# Altium schematic sheet Bottom_Layer.SchDoc
size A4; SheetNumber: 1; SheetTotal: 1
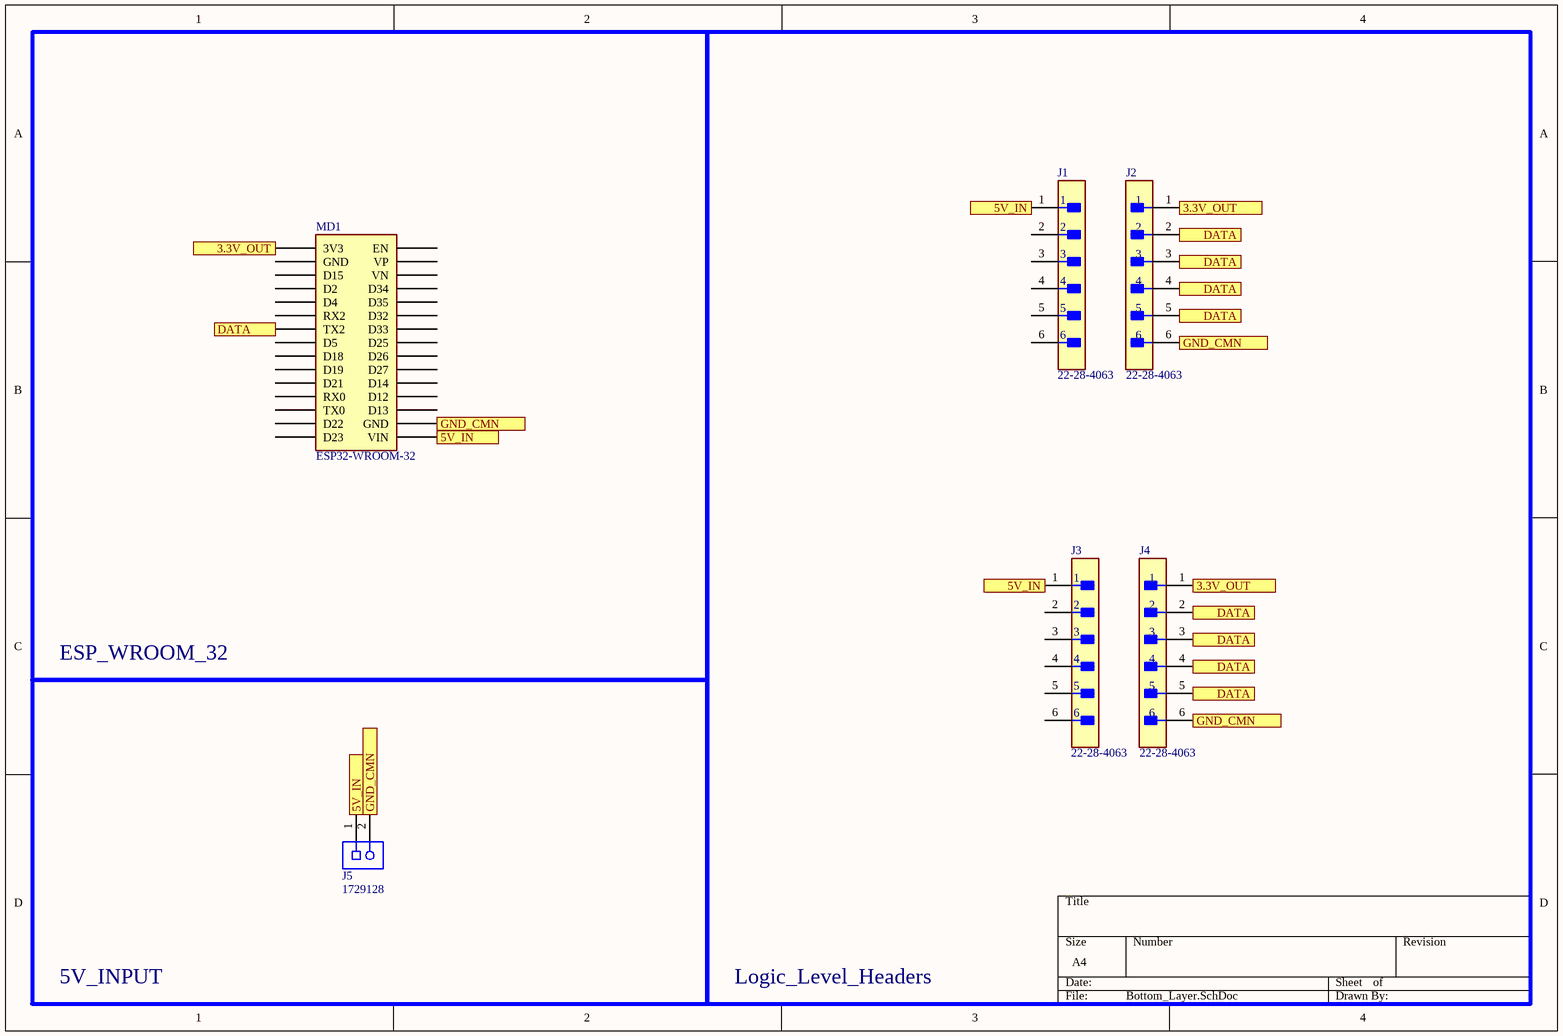
[diagram p0: Bottom_Layer.SchDoc]

## Parts
J1  22-28-4063  [FP-22-28-4063-MFG]
J2  22-28-4063  [FP-22-28-4063-MFG]
J3  22-28-4063  [FP-22-28-4063-MFG]
J4  22-28-4063  [FP-22-28-4063-MFG]
J5  1729128  [PHOE-1729128-2_V]
MD1  ESP32-WROOM-32  [FP-ESP32-WROOM-32-MFG]

## Blocks framed on the sheet
ESP_WROOM_32: MD1
Logic_Level_Headers: J1-J4

## Ports
3.3V_OUT (see TopLayer[1A], TopLayer[4A]), 3.3V_OUT (see TopLayer[1A], TopLayer[4C]), 3.3V_OUT (see TopLayer[4A], TopLayer[4C]), 5V_IN (see TopLayer[1D], TopLayer[2B], TopLayer[3A]), 5V_IN (see TopLayer[1D], TopLayer[2B], TopLayer[3C]), 5V_IN (see TopLayer[1D], TopLayer[3A], TopLayer[3C]), 5V_IN (see TopLayer[2B], TopLayer[3A], TopLayer[3C]), DATA (see TopLayer[1B], TopLayer[4A], TopLayer[4B], TopLayer[4C]), DATA (see TopLayer[1B], TopLayer[4B], TopLayer[4C]), DATA (see TopLayer[4A], TopLayer[4B], TopLayer[4C]), GND_CMN (see TopLayer[1D], TopLayer[2B], TopLayer[4B]), GND_CMN (see TopLayer[1D], TopLayer[2B], TopLayer[4C]), GND_CMN (see TopLayer[1D], TopLayer[4B], TopLayer[4C]), GND_CMN (see TopLayer[2B], TopLayer[4B], TopLayer[4C])

## Nets
3.3V_OUT: J2.1 J4.1 MD1.2(3V3) ; port 3.3V_OUT
5V_IN: J1.1 J3.1 J5.1 MD1.15(VIN) ; port 5V_IN
DATA: J2.2 J2.3 J2.4 J2.5 J4.2 J4.3 J4.4 J4.5 MD1.21(TX2) ; port DATA
GND_CMN: J2.6 J4.6 J5.2 MD1.1(GND) ; port GND_CMN

Not connected (* = marked no-connect by the designer): J1 2 3 4 5 6; J3 2 3 4 5 6; MD1 3(D2) 4(RX0) 5(D21) 6(D12) 7(D13) 8(D27) 9(D14) 10(D33) 11(D25) 12(D26) 17(D18) 18(D19) 19(D15) 20(GND) 22(D5) 28(EN) 30(VP) 31(VN) 32(TX0) 33(D34) 34(D4) 35(RX2) 36(D35) 37(D32) 38(D23) 39(D22)

## Notes on the sheet
- 5V_INPUT

## Library data of the parts
J1-J4 = CMP-04776-000885-1: CONN HEADER VERT 6POS 2.54MM; Number of Circuits: 6; Voltage Rating (DC): 250V; Connector Type: Male Pin; Contact Resistance: 20mR; Glow Wire Compliant: Non-compliant; Gender: Male; Current Rating: 4A; Max Voltage Rating (DC): 250.25kV; Series: KK® 42375; Termination: Solder; Orientation: Straight; Max Operating Temperature: 75°C; Min Operating Temperature: 0°C; Mount: Through Hole; Depth: 2.49mm; Contact Material: Brass; Number of Positions: 6; Contact Mating Length: 0.24inch; Number of Rows: 1; Housing Color: Black; Max Voltage Rating (AC): 250V; Housing Material: Thermoplastic; Packaging: Bulk; Contact Plating: Gold; Contact Type: Male Pin; Package Quantity: 1; Number of Contacts: 6; Voltage Rating: 250V; Lead Free: Lead Free; RoHS Compliant: Yes; Pitch: 2.54mm; Color: Black; Flammability Rating: UL94 V-0; Radiation Hardening: No
J5 = CMP-2000-05815-1: PCB Terminal Block, 13.5 A, 400 V, 2-Pin THD, RoHS, Bulk; Manufacturer: Phoenix Contact; Package Version: 03/2015; No. of Rows: 1; Pitch: 5.08mm; No. of Positions: 2; Voltage Rating: 400V; Current Rating: 13500mA; Manufacturer URL: http://www.phoenixcontact.com/; Datasheet URL: https://datasheet.ciiva.com/16046/1729128-16046181.pdf; RoHS: TRUE; Package URL: https://www.phoenixcontact.com/online/portal/pi/pxc/product_detail_page/!ut/p/b1/3VdJjqNKFDxLH8AFycySyWY2ozFsEPOMMQaDOX1XedGL_1Vdm5YXJleknhSKeBkvI6EA8ncAo3AYoDhBQGco6KN7VURTdemj9us_IEKEZo_YHiPAEWEFmDGOHMORkqKYCORBZxgL7ZoaZYcbFFUZ3fqxSY6GOuxydWUuHqz1ynmMFygu583Bob0Ewr6Sd_l-5m-kAueHiB0jpRwZwe58wwtkpxtMYd_LmGcDRU02dRNEyWt6Y2ti5pSyJ_reIkzIulrqApdnbT11V5jnCKbYNCvhEM1MCpPByat_X379-iThf08CI5GfOPqfBeS3BRoBOdD55AKVv0iLwCMq-2BrzXWSGRH7pUGD9uwXQjiph3xL0DKQwdGa0JImiIOmBNOestqgwTHSSs2oOep-78apyXQBvNi8ZLaFjvjWvcaUEBu0MC6Wbe-d6mB0FAebo2lUWinqYaZs5DAYzV0RP9yitUjnGJ0iI9xhZkT42OCQNUJJhkgWINNQLP2JFP6OpMg3JCVg70jqHT0lvKOnhHf0lPuOnnLf0VPuWx6_dxwUIvwk5WMkT0kLL1mh61l2yZVSzG3pYV_bqo-mj6uMKwKwdnnW8Jh5RTOJzMOA5c-eJDaZQw4mTMPH02PvS_ZAqNVjVTo2WyYLkwH_KU1mmmG5kjRhDqPXLwwVHvVOjCM60-fpXvTDfMGW1PVFVS1r4e4yVDk4ZdNbkUHvqPqQSeian4UD39fNKmachqdJ1NJbyk8rXT9mXTvPk3oE5meulKGgiruPJek-4I9hTT6G8ZLOyRSm2RRVbThERQad5OS28hdt4YW4vG0stgYYzsWsK4_7y6DZMjJSCqri1kyiZR5vD7pwIrNR7QwPHTcLTI5qT7eRlpHrdGiupYlqQDJ7zy_CND8fWWBoLRXxk1RVcXiBQwbTD4Xi7KL-FuO94t9xaqweXzH; PartNumber: 1729128; Package Description: 2-Pin Through Hole Device, Body 8.1 x 10.16 mm, Pitch 5.08 mm; Datasheet Version: 12/2013; Mounting Technology: ThroughHole; Orientation: Horizontal; Package Reference: 1729128-2; Packing: Bulk
MD1 = CMP-194065-000008-1: RX TXRX MOD WIFI SURFACE MOUNT; Frequency: 2.5GHz; Sensitivity: -98dBm; Operating Supply Voltage: 3.6V; Data Rate: 150Mbps; Weight: 0.088185oz; Package Quantity: 550; Min Operating Temperature: -40°C; Mount: Surface Mount; Max Operating Temperature: 85°C; Packaging: Cut Tape; Case/Package: SMD/SMT